# EAGLE design paris_relay_rev_B (EAGLE 6.5.0)
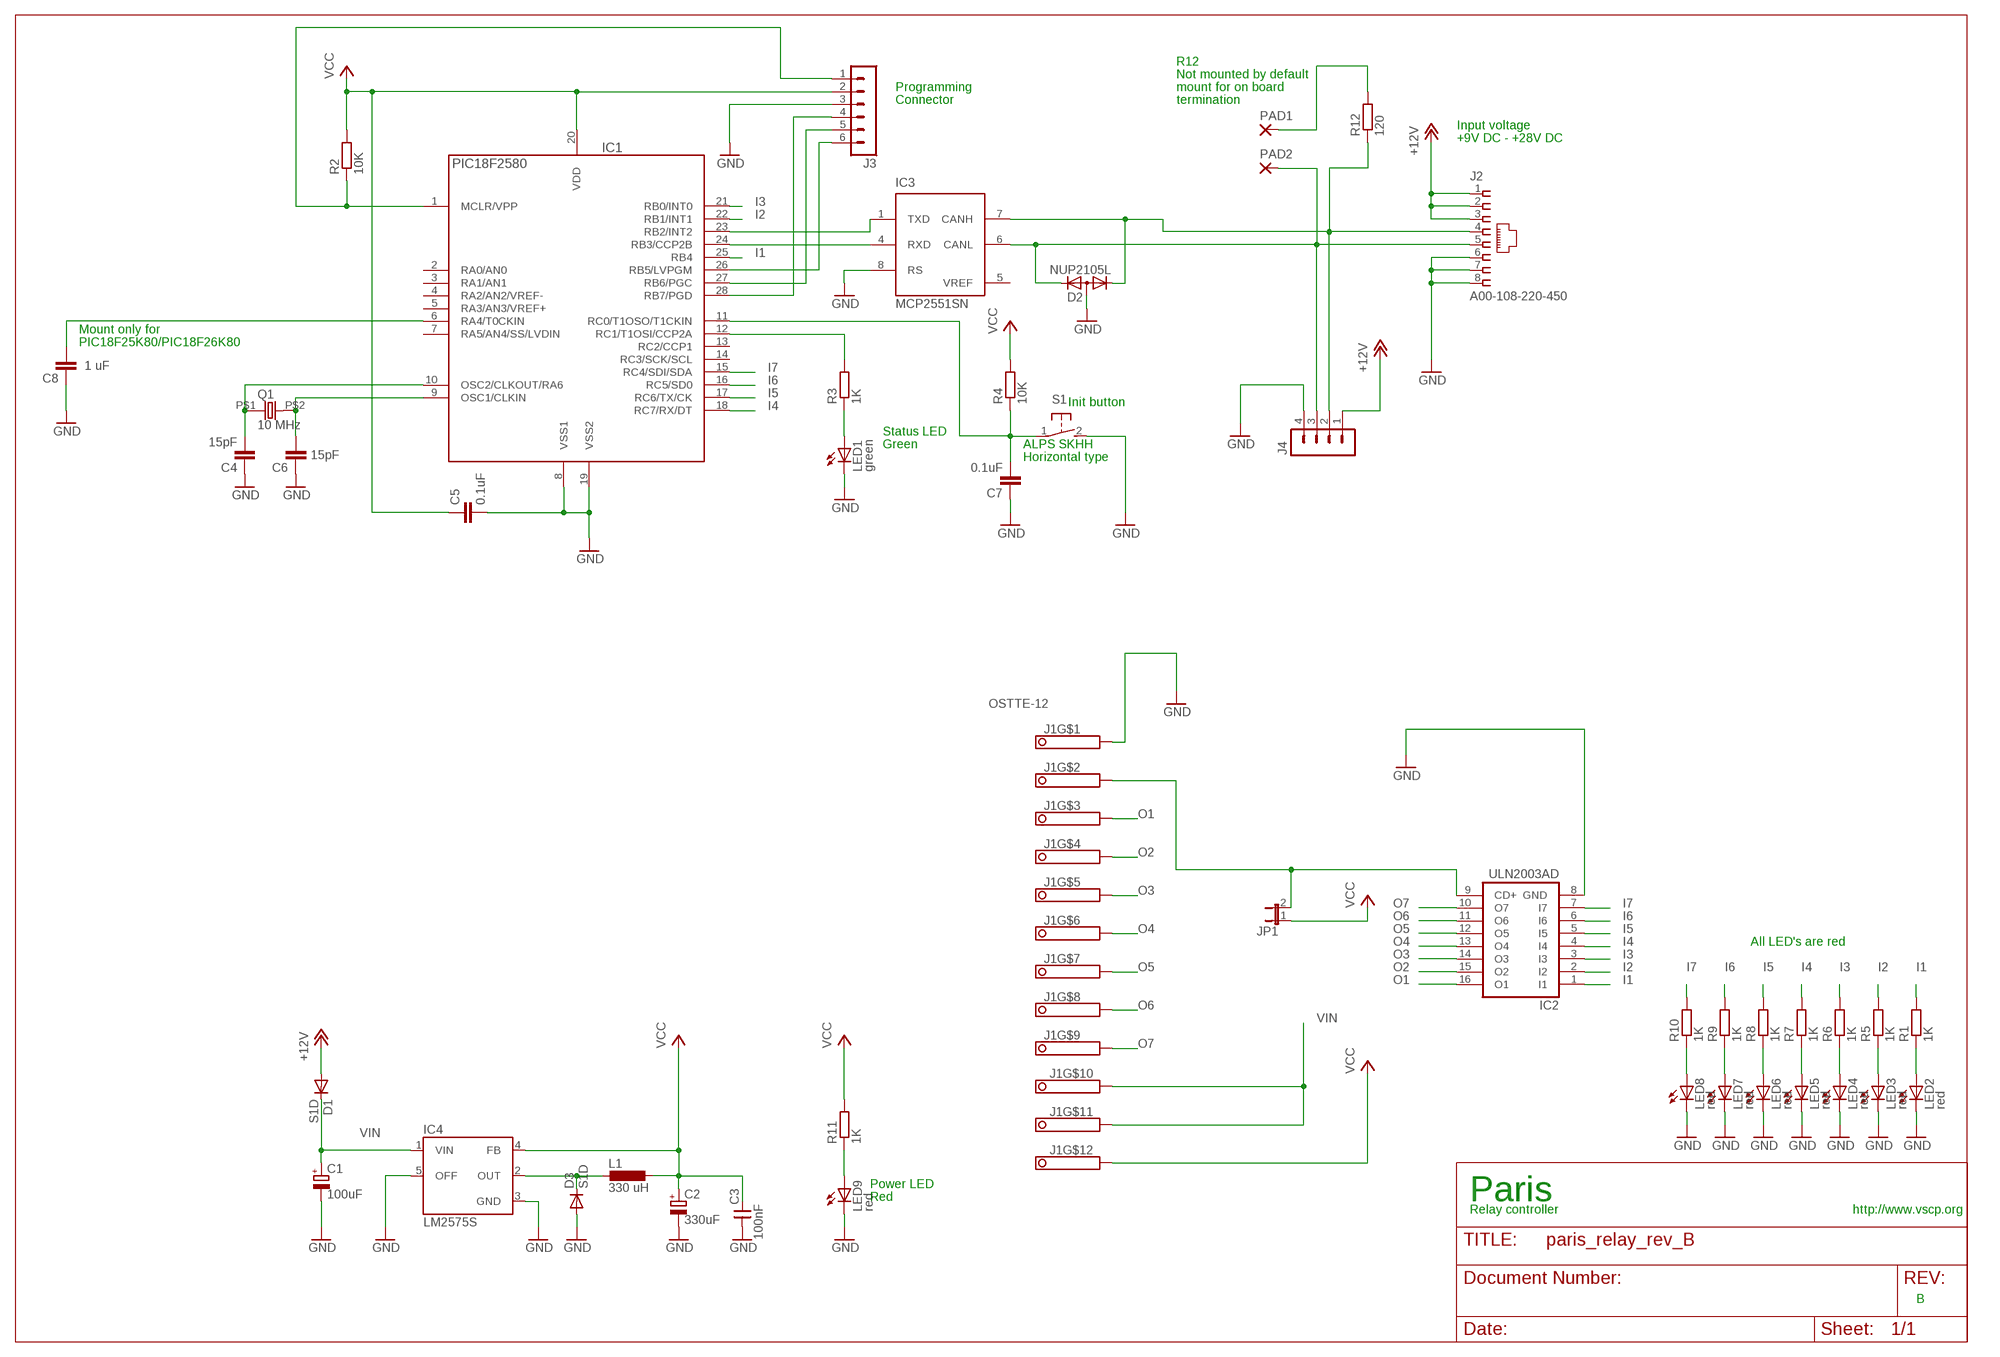
[diagram p0: schematic, sheet 1]

## Parts
C1  100uF  CPOL-EUD  [PANASONIC_D]
C2  330uF  CPOL-EUD  [PANASONIC_D]
C3  100nF  CNP-0805  [0805]
C4  15pF  C-EUC0805  [C0805]
C5  0.1uF  C-EUC0805  [C0805]
C6  15pF  C-EUC0805  [C0805]
C7  0.1uF  C-EUC0805  [C0805]
C8  1 uF  C-EUC0805  [C0805]
D1  S1D  DIODE-SOD123  [SOD123]
D2  NUP2105L  DIODE-2CA|ACSOT23  [SOT23]
D3  S1D  DIODE-SOD123  [SOD123]
IC1  PIC18F2580  PIC18LF252-I/SO  [SO28]
IC2  ULN2003AD  [SO16]
IC3  MCP2551SN  [SO-08]
IC4  LM2575S  [TO263-5]
J1  OSTTE-12  [PINHEAD-12]
J2  A00-108-220-450  [RJ-45]
J3  MA06-1  [MA06-1]
J4  MA04-1  [MA04-1]
JP1  JP1E  [JP1]
L1  330 uH  DO3316P  [DO3316P]
LED1  green  LEDCHIP-LED0805  [CHIP-LED0805]
LED2  red  LEDCHIP-LED0805  [CHIP-LED0805]
LED3  red  LEDCHIP-LED0805  [CHIP-LED0805]
LED4  red  LEDCHIP-LED0805  [CHIP-LED0805]
LED5  red  LEDCHIP-LED0805  [CHIP-LED0805]
LED6  red  LEDCHIP-LED0805  [CHIP-LED0805]
LED7  red  LEDCHIP-LED0805  [CHIP-LED0805]
LED8  red  LEDCHIP-LED0805  [CHIP-LED0805]
LED9  red  LEDCHIP-LED0805  [CHIP-LED0805]
PAD1  1,6/0,8  [1,6/0,8]
PAD2  1,6/0,8  [1,6/0,8]
Q1  10 MHz  HC-49S  [9C]
R1  1K  R-EU_R0805  [R0805]
R2  10K  R-EU_R0805  [R0805]
R3  1K  R-EU_R0805  [R0805]
R4  10K  R-EU_R0805  [R0805]
R5  1K  R-EU_R0805  [R0805]
R6  1K  R-EU_R0805  [R0805]
R7  1K  R-EU_R0805  [R0805]
R8  1K  R-EU_R0805  [R0805]
R9  1K  R-EU_R0805  [R0805]
R10  1K  R-EU_R0805  [R0805]
R11  1K  R-EU_R0805  [R0805]
R12  120  R-EU_R0805  [R0805]
S1  31-XX  [B3F-31XX]

## Nets
+12V: D1.A J2.1 J2.2 J2.3 J4.1
GND: C1.- C2.- C3.1 C4.1 C5.2 C6.1 C7.1 C8.1 D2.3(A) D3.A IC1.8(VSS1) IC1.19(VSS2) IC2.8(GND) IC3.8(RS) IC4.3(GND) IC4.5(OFF) J1.1 J2.6 J2.7 J2.8 J3.3 J4.4 LED1.C LED2.C LED3.C LED4.C LED5.C LED6.C LED7.C LED8.C LED9.C S1.2(S)
I1: IC1.25(RB4) IC2.1(I1) R1.2
I2: IC1.22(RB1/INT1) IC2.2(I2) R5.2
I3: IC1.21(RB0/INT0) IC2.3(I3) R6.2
I4: IC1.18(RC7/RX/DT) IC2.4(I4) R7.2
I5: IC1.17(RC6/TX/CK) IC2.5(I5) R8.2
I6: IC1.16(RC5/SD0) IC2.6(I6) R9.2
I7: IC1.15(RC4/SDI/SDA) IC2.7(I7) R10.2
N$1: D3.C IC4.2(OUT) L1.1
N$2: C4.2 IC1.10(OSC2/CLKOUT/RA6) Q1.P$1
N$3: PAD1.1(P) R12.2
N$4: IC1.12(RC1/T1OSI/CCP2A) R3.2
N$5: LED1.A R3.1
N$6: C7.2 IC1.11(RC0/T1OSO/T1CKIN) R4.1 S1.1(P)
N$7: C6.2 IC1.9(OSC1/CLKIN) Q1.P$2
N$8: IC2.9(CD+) J1.2 JP1.2
N$9: LED2.A R1.1
N$10: LED3.A R5.1
N$11: LED4.A R6.1
N$12: IC1.1(MCLR/VPP) J3.1 R2.1
N$13: IC1.28(RB7/PGD) J3.4
N$14: IC1.27(RB6/PGC) J3.5
N$15: IC1.26(RB5/LVPGM) J3.6
N$16: LED5.A R7.1
N$17: LED6.A R8.1
N$18: LED7.A R9.1
N$19: LED8.A R10.1
N$20: LED9.A R11.1
N$22: D2.1(K1) IC3.7(CANH) J2.4 J4.2 R12.1
N$23: D2.2(K2) IC3.6(CANL) J2.5 J4.3 PAD2.1(P)
N$24: C8.2 IC1.6(RA4/T0CKIN)
O1: IC2.16(O1) J1.3
O2: IC2.15(O2) J1.4
O3: IC2.14(O3) J1.5
O4: IC2.13(O4) J1.6
O5: IC2.12(O5) J1.7
O6: IC2.11(O6) J1.8
O7: IC2.10(O7) J1.9
RXCAN: IC1.24(RB3/CCP2B) IC3.4(RXD)
TXCAN: IC1.23(RB2/INT2) IC3.1(TXD)
VCC: C2.+ C3.2 C5.1 IC1.20(VDD) IC4.4(FB) J1.12 J3.2 JP1.1 L1.2 R2.2 R4.2 R11.2
VIN: C1.+ D1.C IC4.1(VIN) J1.10 J1.11
Unconnected: IC1.2(RA0/AN0) IC1.3(RA1/AN1) IC1.4(RA2/AN2/VREF-) IC1.5(RA3/AN3/VREF+) IC1.7(RA5/AN4/SS/LVDIN) IC1.13(RC2/CCP1) IC1.14(RC3/SCK/SCL)

## Notes on the sheet
- R12
- Not mounted by default
- Programming | mount for on board
- Connector | termination
- Input voltage
- +9V DC - +28V DC
- Mount only for
- PIC18F25K80/PIC18F26K80
- Init button
- Status LED
- Green | ALPS SKHH
- Horizontal type
- All LED's are red
- Power LED
- Red | Paris
- Relay controller | http://www.vscp.org
- B

## Power pins joined to a net without a drawn wire
GND: IC3.2(VSS)
VCC: IC3.3(VDD)
VREF: IC3.5(VREF)

## Library data of the parts
C1 C2 = rcl:CPOL-EU: POLARIZED CAPACITOR, European symbol
C3 = cap-master:CNP-: NON-POLARIZED CAP
C4-C8 = rcl:C-EU: CAPACITOR, European symbol
D1 D3 = diode:DIODE-: DIODE
D2 = diode:DIODE-2CA|AC: Dual DIODE Cathode-Anode|Anode-Cathode
IC1 = pic_olin:PIC18*F252-?: 18F252, 28 pin, 32Kb prog, 1536 data, 256 EEPROM
IC2 = uln-udn:ULN2003A: DRIVER ARRAY
IC3 = microchip_can:MCP2551: High Speed CAN tranceiver
IC4 = v-reg-3:LM2575: National Semiconductor <http://www.national.com> 1.0A "Simple Switcher"(c) 52kHz, Vout 1.23-37V (HV: 57V), Vin 40V (HV: 60V), 50µA standby current
J1 = vscpcan:OSTTE-12
J2 = vscpcan:A00-108-220-450
J3 = con-lstb:MA06-1: PIN HEADER; OC_FARNELL: unknown; OC_NEWARK: unknown
J4 = con-lstb:MA04-1: PIN HEADER; OC_FARNELL: unknown; OC_NEWARK: unknown
JP1 = jumper:JP1E: JUMPER
L1 = inductor-coilcraft:DO3316P: COILCRAFT; OC_FARNELL: unknown; OC_NEWARK: unknown
LED1-LED9 = led:LED: LED OSRAM: - CHIPLED LG R971, LG N971, LY N971, LG Q971, LY Q971, LO R971, LY R971 LH N974, LH R974 LS Q976, LO Q976, LY Q976 LO Q996 - Hyper CHIPLED LW Q18S LB Q993, LB Q99A, LB R99A - SideLED LS A670, LO A670, LY A670, LG A670, LP A670 LB A673, LV A673, LT A673, LW A673 LH A674 LY A675 LS A676, LA A676, LO A676, LY A676, LW A676 LS A679, LY A679, LG A679 - Hyper Micro SIDELED® LS Y876, LA Y876, LO Y876, LY Y876 LT Y87S - SmartLED LW L88C, LW L88S LB L89C, LB L89S, LG L890 LS L89K, LO L89K, LY L89K LS L896, LA L896, LO L896, LY L896 - TOPLED LS T670, LO T670, LY T670, LG T670, LP T670 LSG T670, LSP T670, LSY T670, LOP T670, LYG T670 LG T671, LOG T671, LSG T671 LB T673, LV T673, LT T673, LW T673 LH T674 LS T676, LA T676, LO T676, LY T676, LB T676, LH T676, LSB T676, LW T676 LB T67C, LV T67C, LT T67C, LS T67K, LO T67K, LY T67K, LW E67C LS E67B, LA E67B, LO E67B, LY E67B, LB E67C, LV E67C, LT E67C LW T67C LS T679, LY T679, LG T679 LS T770, LO T770, LY T770, LG T770, LP T770 LB T773, LV T773, LT T773, LW T773 LH T774 LS E675, LA E675, LY E675, LS T675 LS T776, LA T776, LO T776, LY T776, LB T776 LHGB T686 LT T68C, LB T68C - Hyper Mini TOPLED® LB M676 - Mini TOPLED Santana® LG M470 LS M47K, LO M47K, LY M47K Source: http://www.osram.convergy.de LUXEON: - LUMILED® LXK2-PW12-R00, LXK2-PW12-S00, LXK2-PW14-U00, LXK2-PW14-V00 LXK2-PM12-R00, LXK2-PM12-S00, LXK2-PM14-U00 LXK2-PE12-Q00, LXK2-PE12-R00, LXK2-PE12-S00, LXK2-PE14-T00, LXK2-PE14-U00 LXK2-PB12-K00, LXK2-PB12-L00, LXK2-PB12-M00, LXK2-PB14-N00, LXK2-PB14-P00, LXK2-PB14-Q00 LXK2-PR12-L00, LXK2-PR12-M00, LXK2-PR14-Q00, LXK2-PR14-R00 LXK2-PD12-Q00, LXK2-PD12-R00, LXK2-PD12-S00 LXK2-PH12-R00, LXK2-PH12-S00 LXK2-PL12-P00, LXK2-PL12-Q00, LXK2-PL12-R00 Source: www.luxeon.com KINGBRIGHT: KA-3528ASYC Source: www.kingbright.com
PAD1 PAD2 = wirepad:1,6/0,8: THROUGH-HOLE PAD
Q1 = vscpcan:HC-49S: Digikey 887-1050-1-nd
R1-R12 = rcl:R-EU_: RESISTOR, European symbol
S1 = switch-omron:31-XX: OMRON SWITCH; MPN: B3F-3100; OC_FARNELL: 959704; OC_NEWARK: 36M3582

## Board
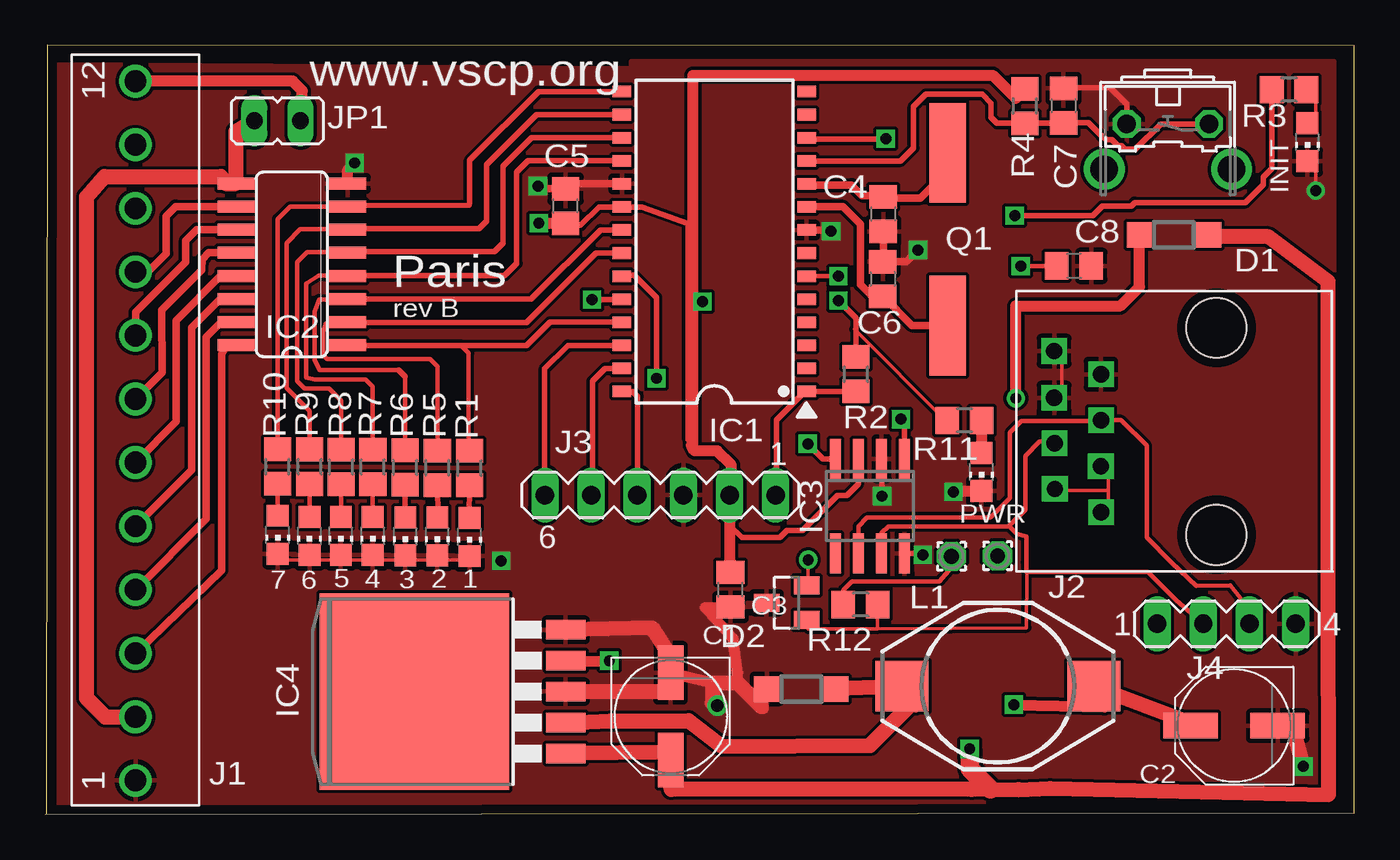
[diagram p1: board, top side]
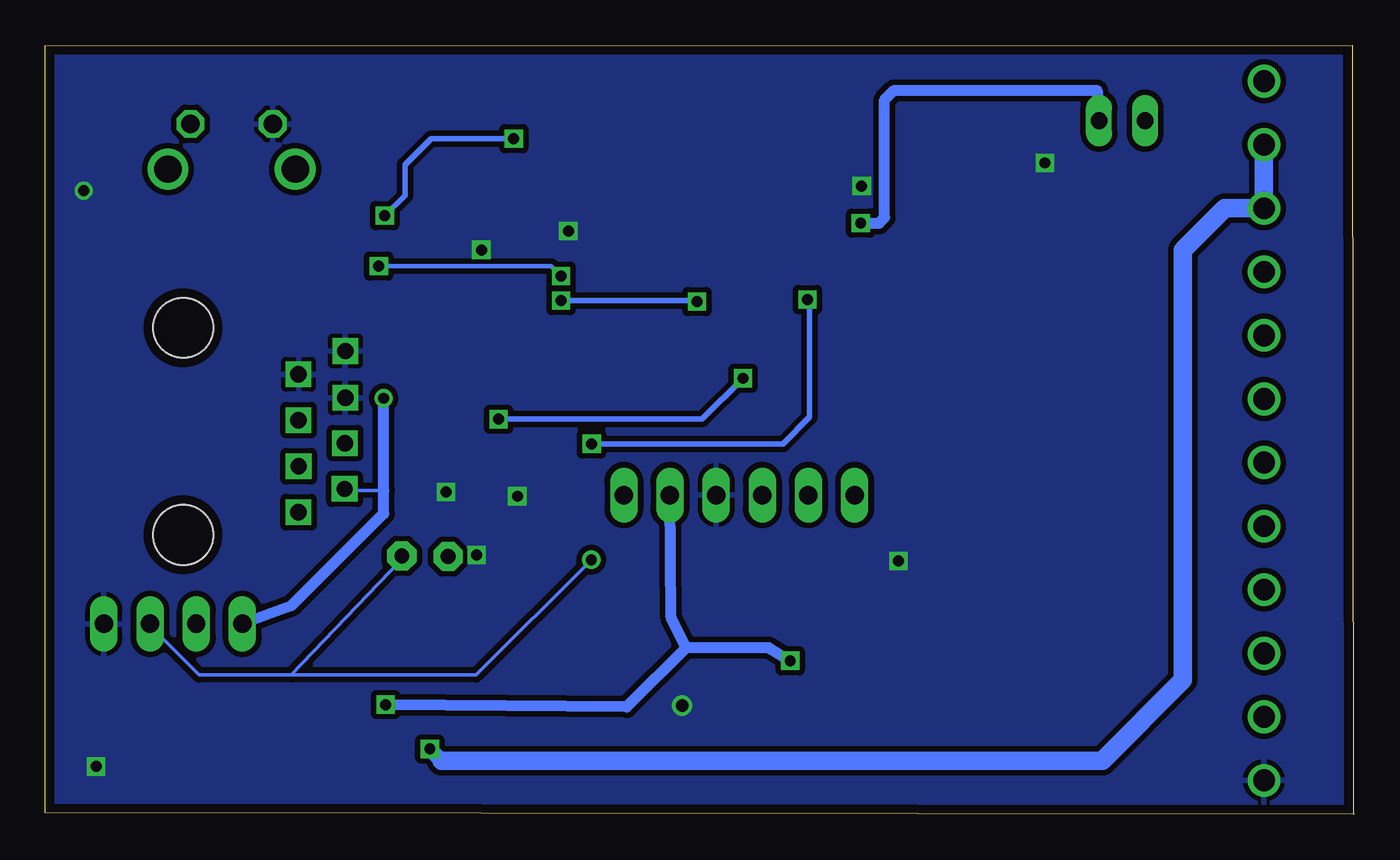
[diagram p2: board, bottom side, seen from below]

Size 72.04 x 42.34 mm. Coordinates in mm from the lower left corner, seen from the top.
Outline: 0,0 72.04,0.09 72.04,42.31 0.09,42.34 0.04,0.01
Copper layers (1*16): Top 0.0356mm / dielectric 1.5011mm / Bottom 0.0356mm
Design rules "SilverCircuits": minimum track width 7mil, minimum drill 14mil, track to track 7mil, track to pad 7mil, pad to pad 7mil, via to via 7mil, smd to smd 0mil, copper to edge 20mil, drill to drill 8mil, minimum pad ring 10mil, minimum via ring 8mil, stop-mask expansion 4mil, vias tented up to drill 0mil, thermal gap 10mil

### Footprints (pad centres in the part's own frame; a part is rotated, then mirrored left to right if it is on the bottom)
PANASONIC_D = smd 3 x 1.4: + 2.4,0; - -2.4,0
0805 = smd 1.27 x 1.524: 1 -0.953,0; 2 0.953,0
C0805 = smd 1.3 x 1.5: 1 -0.95,0; 2 0.95,0
SOD123 = smd 1.4 x 1.4: A 1.9,0; C -1.9,0
SOT23 = smd 1 x 1.4: 1 -0.95,-1.1; 2 0.95,-1.1; 3 0,1.1
SO28 = smd 0.635 x 1.016: 1 -8.255,-5.08; 2 -6.985,-5.08; 3 -5.715,-5.08; 4 -4.445,-5.08; 5 -3.175,-5.08; 6 -1.905,-5.08; 7 -0.635,-5.08; 8 0.635,-5.08; 9 1.905,-5.08; 10 3.175,-5.08; 11 4.445,-5.08; 12 5.715,-5.08; 13 6.985,-5.08; 14 8.255,-5.08; 15 8.255,5.08; 16 6.985,5.08; 17 5.715,5.08; 18 4.445,5.08; 19 3.175,5.08; 20 1.905,5.08; 21 0.635,5.08; 22 -0.635,5.08; 23 -1.905,5.08; 24 -3.175,5.08; 25 -4.445,5.08; 26 -5.715,5.08; 27 -6.985,5.08; 28 -8.255,5.08
SO16 = smd 0.66 x 2.032: 1 -4.445,-3.073; 2 -3.175,-3.073; 3 -1.905,-3.073; 4 -0.635,-3.073; 5 0.635,-3.073; 6 1.905,-3.073; 7 3.175,-3.073; 8 4.445,-3.073; 9 4.445,3.073; 10 3.175,3.073; 11 1.905,3.073; 12 0.635,3.073; 13 -0.635,3.073; 14 -1.905,3.073; 15 -3.175,3.073; 16 -4.445,3.073
SO-08 = smd 0.6 x 2.2: 1 -1.905,-2.6; 2 -0.635,-2.6; 3 0.635,-2.6; 4 1.905,-2.6; 5 1.905,2.6; 6 0.635,2.6; 7 -0.635,2.6; 8 -1.905,2.6
TO263-5 = smd 1.067 x 2.159: 1 -3.404,-5.791; 2 -1.702,-5.791; 3 0,-5.791; 4 1.702,-5.791; 5 3.404,-5.791 | smd 10.8 x 10.41: 6 0,2.54
PINHEAD-12 = drill 1.2: 1 -17.5,0; 2 -14,0; 3 -10.5,0; 4 -7,0; 5 -3.5,0; 6 0,0; 7 3.5,0; 8 7,0; 9 10.5,0; 10 14,0; 11 17.5,0; 12 21,0
RJ-45 = drill 0.9 square: 1 -4.45,6.35; 2 -3.17,8.89; 3 -1.92,6.36; 4 -0.65,8.91; 5 0.62,6.35; 6 1.84,8.93; 7 3.14,6.35; 8 4.42,8.93 | hole 3.3: -5.7,0; 5.7,0
MA06-1 = drill 1.016 long: 1 -6.35,0; 2 -3.81,0; 3 -1.27,0; 4 1.27,0; 5 3.81,0; 6 6.35,0
MA04-1 = drill 1.016 long: 1 -3.81,0; 2 -1.27,0; 3 1.27,0; 4 3.81,0
JP1 = drill 0.914 long: 1 0,-1.27; 2 0,1.27
DO3316P = smd 2.92 x 2.79: 1 -5.28,0; 2 5.28,0
CHIP-LED0805 = smd 1.2 x 1.2: A 0,-1.05; C 0,1.05
1,6/0,8 = drill 0.813 pad 1.6 octagon: 1 0,0
9C = smd 5.5 x 2: P$1 -4.74,0; P$2 4.76,0
R0805 = smd 1.3 x 1.5: 1 -0.95,0; 2 0.95,0
B3F-31XX = drill 1.016 octagon: 1 -2.261,-1.245; 2 2.261,-1.245 | drill 1.499 pad 2.159: 3 -3.505,1.245; 4 3.505,1.245

### Placement (x,y rotation side)
C1  34.42,5.39 270 top
C2  65.44,4.89 180 top
C3  37.71,12.37 90 top
C4  46.12,33.05 90 top
C5  28.63,33.49 90 top
C6  46.09,29.48 270 top
C7  56.05,39.02 270 top
C8  56.62,30.2 180 top
D1  62.12,31.91 180 top
D2  40.8,11.65 90 top
D3  41.61,6.9 180 top
IC1  36.82,31.54 90 top
IC2  13.57,30.28 90 top
IC3  45.39,16.98 180 top
IC4  22.85,6.76 90 top
J1  4.96,19.37 90 top
J2  64.46,21.09 90 top
J3  33.85,17.58 180 top
J4  65.01,10.49 0 top
JP1  12.77,38.2 90 top
L1  52.43,7.06 0 top
LED1  69.47,37.01 180 top
LED2  23.35,15.27 180 top
LED3  21.57,15.3 180 top
LED4  19.81,15.3 180 top
LED5  18.02,15.33 180 top
LED6  16.26,15.33 180 top
LED7  14.54,15.33 180 top
LED8  12.79,15.39 180 top
LED9  51.53,18.85 180 top
PAD1  49.88,14.2 0 top
PAD2  52.42,14.23 0 top
Q1  49.66,31.68 270 top
R1  23.35,19.07 90 top
R2  44.62,24.24 90 top
R3  68.46,39.9 180 top
R4  53.92,39 90 top
R5  21.58,19.08 90 top
R6  19.8,19.1 90 top
R7  18.02,19.13 90 top
R8  16.28,19.13 90 top
R9  14.55,19.14 90 top
R10  12.78,19.15 90 top
R11  50.59,21.69 180 top
R12  44.87,11.55 180 top
S1  61.79,36.77 180 top

### Tracks (layer width: path | path; a pad name or v marks a point on that pad's centre or on a via)
+12V  (via drill 0.6)
  Top 0.203: 58.5,17.83 55.96,17.83 J2.2 | 58.5,17.83 58.5,19.1 J2.3 | 58.5,17.83 58.5,16.56 J2.1
  Top 0.61: v53.42,22.91 53.42,27.99 59.17,27.99 60.22,29.04 D1.A
  Bottom 0.203: 53.42,17.83 55.96,17.83 J2.2
  Bottom 0.61: 53.5,22.91 v53.42,22.91 53.42,17.83 53.42,16.56 58.5,11.48 J4.1
GND  (via drill 0.6, 0.7)
  Top 0.203: v69.93,34.34 69.93,35.61 LED1.C | 20.4,14.02 21.67,14.02 | 21.67,14.02 22.94,14.02 LED2.C | 21.67,14.02 LED3.C | 16.59,14.02 17.86,14.02 | 14.05,14.02 12.78,14.02 LED8.C | 14.05,14.02 16.59,14.02 | 16.59,14.02 LED6.C | 14.05,14.02 LED7.C | 17.86,14.02 20.4,14.02 | 20.4,14.02 LED4.C | 17.86,14.02 LED5.C | IC4.5 28.02,10.21 | J2.6 55.96,22.91 55.96,25.45 J2.8
  Top 0.254: 36.71,7.23 36.71,7.41
  Top 0.305: IC3.8 48.22,14.38 v48.31,14.29 | v46.06,17.52 46.06,19.55 IC3.2 | S1.2 59.53,39.11 58.63,40.01 56.09,40.01 C7.1
  Top 0.406: IC1.19 28.9,34.71 C5.2 27.27,34.44 v27.11,34.6 | 46.05,32.17 C4.1 46.12,30.46 C6.1 47.39,30.43 v48.04,31.08 | IC1.8 43.18,32.17 v43.25,32.11
  Top 0.61: 34.73,6.77 34.41,6.7 34.7,7.26 34.73,7.23 | 34.73,7.23 34.78,7.18 | 34.73,7.23 C1.- | 39.5,5.83 39.41,5.93 D3.A 39.52,6.94 | C1.- 36.71,7.23 | 39.52,6.94 39.62,6.84 | 39.52,6.94 39.01,6.51 | 34.52,7.2 34.42,7.1 | C1.- 34.52,7.2 | 34.55,8.5 34.55,7.23 34.52,7.2 | 36.71,6.14 v36.99,5.99 | C2.- 68.65,4.78 | IC2.8 16.64,35.49 v17.02,35.87 | 38.1,7.23 38.1,7.79 37.85,9.68 36.33,11.39 C3.1 | LED9.C 50.03,17.8 v49.98,17.75
  Top 0.813: IC4.3 34.73,6.77 | 39.41,5.93 38.1,7.23 36.71,7.23 36.71,6.14 | IC4.5 33.42,10.26 34.55,8.5 | 68.65,4.78 v69.25,2.64
  other vias: 25.08,13.95
  pour Bottom (isolate 0.305): -0.22,1.63 1.44,-1.72 71.42,-2.09 73.46,1.28 73.18,34.45 71.6,43.71 0.21,43.61 -0.71,34.03
  pour Top: 0.73,41.31 0.72,0.05 71.52,0.78 71.52,1.18 70.95,1.18 70.95,41.48 32.25,41.48 32.25,41.08
I1
  Top 0.254: 23.3,19.81 23.3,25.39 22.87,25.82
  Top 0.305: IC1.25 27.77,27.1 26.5,25.82 22.87,25.82 16.66,25.82 IC2.1 | R1.2 23.3,19.81
I2
  Top 0.254: R5.2 21.58,24.66 21.18,25.06 15.52,25.06 15.28,25.29 15.28,26.6 15.44,27.01
  Top 0.305: IC1.22 30.31,30.91 26.5,27.09 16.66,27.09 IC2.2 16.54,27.01 15.44,27.01
I3
  Top 0.254: R6.2 19.8,24.1 | 19.43,24.47 15.09,24.47 14.81,25.01 14.81,27.68 15.06,28.35 16.61,28.35
  Top 0.305: IC1.21 30.54,32.17 26.73,28.36 16.66,28.36 IC2.3 16.61,28.35 | 19.8,24.1 19.43,24.47
I4
  Top 0.254: R7.2 18.02,23.56 17.64,23.94 14.82,23.94 14.35,24.05 14.35,29.23 15.03,29.67 16.62,29.67 IC2.4
  Top 0.305: IC1.18 26.57,35.98 25.94,35.35 25.94,30.33 25.28,29.67 16.66,29.67 IC2.4
I5
  Top 0.254: R8.2 16.28,22.79 15.63,23.44 14.28,23.44 13.87,23.85 13.87,30.41 14.41,30.95 16.61,30.95 IC2.5
  Top 0.305: IC1.17 26.76,37.25 25.19,35.68 25.19,31.46 24.72,30.99 16.71,30.99 IC2.5
I6
  Top 0.254: R9.2 14.55,22.2 13.27,23.48 13.27,31.46 14.03,32.22 16.61,32.22 IC2.6
  Top 0.305: IC1.16 27.04,38.52 24.29,35.77 24.29,32.67 23.87,32.25 16.7,32.25 IC2.6
I7
  Top 0.254: R10.2 12.78,32.78 13.46,33.46 IC2.7
  Top 0.305: IC1.15 27.14,39.79 23.36,36.01 23.36,33.66 23.31,33.55 16.7,33.52 IC2.7
N$1
  Top 0.61: 47.91,5.91 47.86,5.96 L1.1 47.51,5.91 | IC4.2 28.73,5 28.61,4.94
  Top 0.813: L1.1 D3.C | 47.51,5.91 45.4,3.8 37.24,3.75 35.43,5.16 31.1,5.15 28.69,5.05 28.73,5
N$2
  Top 0.406: Q1.P$1 49.66,35.42 48.18,33.94 45.74,33.94 45.6,34.08 | 45.6,34.08 46.04,34.08 C4.2 | 45.6,34.08 44.95,34.08 44.38,34.65 41.96,34.65 IC1.10
N$3
  Top 0.254: PAD1.1 49.9,13.62 49.21,12.83 44.4,12.83 43.93,12.36 R12.2
N$4  (via drill 0.6)
  Top 0.305: IC1.12 42,37.25 42.09,37.17 46.22,37.17 v46.26,37.21 | v53.36,32.97 57.66,32.97 58.18,33.49 59.77,33.49 59.97,33.69 66.06,33.69 67.04,34.67 67.04,35.09 67.51,35.56 R3.2
  Bottom 0.305: v46.26,37.21 50.81,37.21 52.25,35.77 52.25,34.08 v53.36,32.97
N$5
  Top 0.203: 69.93,39.42 69.93,38.15 LED1.A
  Top 0.254: 69.93,39.42 R3.1
N$6
  Top 0.305: IC1.11 41.91,35.97 47.07,35.97 47.79,36.69 47.79,38.97 48.47,39.65 51.57,39.65 52.06,39.16 52.06,38.38 52.39,38.05 R4.1 56.03,38.05 C7.2 56.07,38.09 57.4,38.09 58.15,37.34 58.21,37.34 58.41,37.14 58.7,37.14 59.03,36.81 59.22,36.81 59.41,36.62 60,36.62 61.39,38.02 S1.1
N$7
  Top 0.406: Q1.P$2 47.7,26.92 C6.2 45.49,28.53 44.86,29.16 44.86,32.5 43.91,33.45 IC1.9
N$8
  Top 0.813: J1.2 3.29,5.37 2.27,6.39 2.27,34.01 3.24,35.12 9.65,35.12 9.9,34.73 IC2.9 10.49,37.61 JP1.2
N$9
  Top 0.305: R1.1 23.32,16.35 LED2.A
N$10
  Top 0.305: R5.1 21.62,16.32 LED3.A
N$11
  Top 0.305: R6.1 LED4.A
N$12
  Top 0.305: IC1.1 R2.1 41.82,23.29 40.24,21.71 40.24,17.62 J3.1
N$13
  Top 0.305: IC1.28 32.32,23.29 32.6,23.01 32.6,17.6 J3.4
N$14
  Top 0.305: IC1.27 30.81,24.55 30.11,23.85 30.11,17.65 J3.5
N$15
  Top 0.305: IC1.26 28.76,25.82 27.49,24.55 J3.6
N$16
  Top 0.254: LED5.A R7.1
N$17
  Top 0.254: R8.1 16.28,16.4 LED6.A
N$18
  Top 0.254: R9.1 LED7.A
N$19
  Top 0.254: R10.1 LED8.A
N$20
  Top 0.61: R11.1 LED9.A
N$22
  Top 0.203: 45.8,10.21 41.99,10.21 D2.1 | 45.8,10.21 54.01,10.27 54.02,13.39 53.99,15.29 | 45.8,10.21 45.8,11.48 R12.1
  Top 0.254: IC3.7 46.02,15.49 46.4,15.86 53.03,15.86 53.05,15.88 | 53.05,15.88 53.94,16.77 53.94,19.74 54.72,20.52 55.47,20.52 J2.4 | J4.2 62.24,11.8 60.68,13.36 54.01,13.36 53.99,13.88 53.99,15.29 53.49,15.44 53.05,15.88
N$23  (via drill 0.6)
  Top 0.203: v41.99,14.02 41.99,12.75 D2.2
  Top 0.254: IC3.6 44.75,15.87 45.23,16.34 52.03,16.34 53.1,17.41 53.1,21.04 53.72,21.66 58.06,21.66 J2.5 59.21,21.71 60.62,20.3 60.62,15.24 61.98,13.88 63.36,12.58 65.23,12.61 66,11.65 J4.3
  Bottom 0.203: 58.5,7.67 63.58,7.67 66.12,10.21 J4.3 | v41.99,14.02 48.34,7.67 58.5,7.67 | 58.5,7.67 52.45,14.02 PAD2.1
N$24  (via drill 0.6)
  Top 0.254: C8.2 v53.7,30.2 v53.69,30.19 | v43.65,29.64 IC1.6
  Bottom 0.254: v53.69,30.19 44.2,30.19 v43.65,29.64
O1
  Top 0.406: IC2.16 10,25.84 9.69,25.37 9.69,13.44 J1.3
O2
  Top 0.406: IC2.15 9.68,27.11 8.86,26.29 8.86,16.27 J1.4
O3
  Top 0.406: IC2.14 9.63,28.38 8.06,26.81 8.06,18.97 J1.5
O4
  Top 0.406: IC2.13 9.65,29.68 7.21,27.2 7.21,21.62 J1.6
O5
  Top 0.406: IC2.12 8.98,30.92 8.62,30.56 8.59,29.97 6.39,27.77 6.42,24.33 J1.7
O6
  Top 0.406: J1.8 4.96,27.65 7.73,30.42 7.73,31.6 8.34,32.21 10.47,32.21 IC2.11
O7
  Top 0.406: J1.9 5.63,29.87 6.65,30.89 6.65,32.95 7.17,33.47 IC2.10
RXCAN  (via drill 0.6)
  Top 0.305: IC3.4 42.79,19.58 v41.97,20.4 | v30.09,28.35 31.72,28.35 IC1.24
  Bottom 0.305: v41.97,20.4 31.45,20.4 29.98,21.87 29.98,28.24 v30.09,28.35
TXCAN  (via drill 0.6)
  Top 0.305: IC3.1 47.3,21.55 v47.09,21.76 | v33.64,24.01 33.64,28.46 32.4,29.7 31.8,29.7 IC1.23
  Bottom 0.305: v47.09,21.76 35.89,21.76 v33.64,24.01
VCC  (via drill 0.6)
  Top 0.203: R11.2 49.61,21.64 44.53,26.72 44.62,26.72
  Top 0.254: 35.56,20.32 35.64,20.37
  Top 0.305: C5.1 28.73,32.44 29.46,32.44 30.46,33.45 IC1.20 32.84,33.45 35.38,32.53 35.38,28.13 | 35.38,28.13 35.38,20.63 35.56,20.32 | J3.2 37.76,17.68 | 30.94,8.41 v31.04,8.46 | IC3.3 44.75,18.2 44.11,17.55 43.59,17.55 41.67,15.63 40.82,15.63 40.43,15.24 38.34,15.24 37.66,15.92 | 58.3,5.92 L1.2 | R2.2 44.62,26.72 44.62,27.33 v43.66,28.29 | v36.17,28.24 35.49,28.24 35.38,28.13
  Top 0.406: 63.13,5 C2.+
  Top 0.61: 35.56,20.32 35.74,20.01 36.98,20.01 37.76,19.23 37.76,17.68 | IC4.4 30.94,8.41 | C3.2 37.74,13.88 37.66,13.89 37.66,15.92 J3.2 | J1.12 13.61,40.37 14.14,39.84 14.14,38.71 JP1.1 | C5.1 v27.17,32.54 v27.16,32.55 | v53.31,6.04 58.3,5.92 | 35.64,20.37 35.64,40.69 52.15,40.69 53.42,39.42 R4.2
  Top 0.813: L1.2 63.13,5
  Bottom 0.305: v43.66,28.29 36.22,28.29 v36.17,28.24
  Bottom 0.61: J3.2 37.59,10.85 36.79,9.17 | 36.79,9.17 32.22,9.17 v31.04,8.46 | v27.16,32.55 26.15,32.55 25.84,32.86 25.84,39.35 25.33,39.86 14.16,39.86 14.14,39.84 14.14,38.71 JP1.1 | v53.31,6.04 40.04,5.92 36.79,9.17
VIN  (via drill 0.6)
  Top 0.406: C1.+ 34.43,3.41 | D1.C 64.56,31.91 64.66,31.81
  Top 0.813: 34.43,3.41 IC4.1 | 64.66,31.81 67.33,31.81 70.61,29.34 70.61,11.93 70.64,1.09 55.31,1.43 53.57,1.36 52.02,1.39 51.67,1.39 50.99,1.38 34.44,1.38 C1.+
  Top 1.016: v50.88,3.6 50.88,2.52 52.02,1.39
  Bottom 0.813: 50.24,2.96 v50.88,3.6
  Bottom 1.016: J1.11 J1.10 7.13,33.37 9.43,31.07 9.43,7.4 13.87,2.96 50.24,2.96

### Text on the board
tNames: www.vscp.org | INIT | Paris | rev B | PWR | 7 | 6 | 5 | 4 | 3 | 2 | 1